# EAGLE design Leddriverboard (EAGLE 6.4)
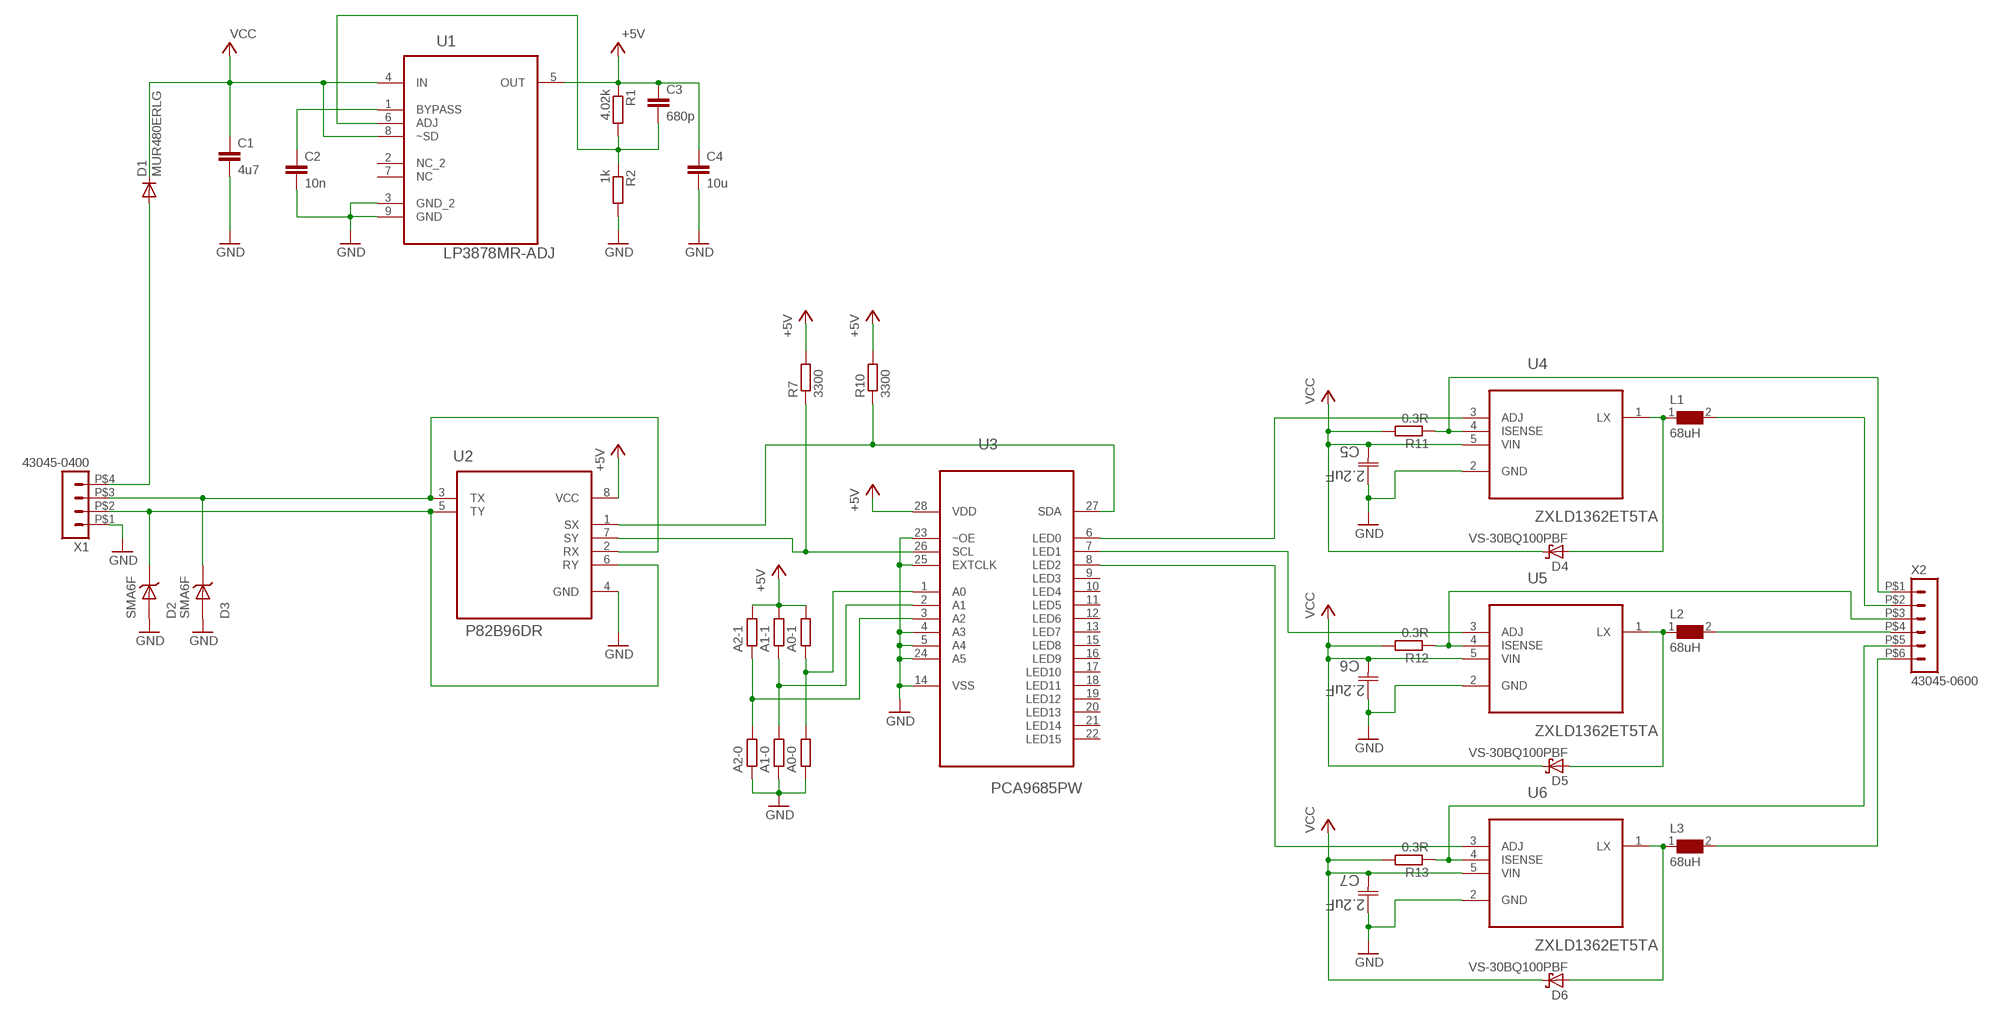
[diagram p0: schematic, sheet 1]

## Parts
C1  4u7  C-EUC0805  [C0805]
C2  10n  C-EUC0805  [C0805]
C3  680p  C-EUC0805  [C0805]
C4  10u  C-EUC0805  [C0805]
C5  2.2uF  08053C225KAT2A  [CAPC2013X152N]
C6  2.2uF  08053C225KAT2A  [CAPC2013X152N]
C7  2.2uF  08053C225KAT2A  [CAPC2013X152N]
D1  MUR480ERLG  MUR150RL  [DO41-10]
D2  SMA6F  [DO-221AC]
D3  SMA6F  [DO-221AC]
D4  VS-30BQ100PBF  [DO-214AB]
D5  VS-30BQ100PBF  [DO-214AB]
D6  VS-30BQ100PBF  [DO-214AB]
L1  68uH  WE-PD4-74456168_L  [L]
L2  68uH  WE-PD4-74456168_L  [L]
L3  68uH  WE-PD4-74456168_L  [L]
R1  4.02k  R-EU_R0603  [R0603]
R2  1k  R-EU_R0603  [R0603]
R3  A2-1  R-EU_R0402  [R0402]
R4  A2-0  R-EU_R0402  [R0402]
R5  A1-1  R-EU_R0402  [R0402]
R6  A1-0  R-EU_R0402  [R0402]
R7  3300  R-EU_0204/7  [0204/7]
R8  A0-1  R-EU_R0402  [R0402]
R9  A0-0  R-EU_R0402  [R0402]
R10  3300  R-EU_0204/7  [0204/7]
R11  0.3R  R-EU_R0603  [R0603]
R12  0.3R  R-EU_R0603  [R0603]
R13  0.3R  R-EU_R0603  [R0603]
U1  LP3878MR-ADJ  [SOIC127P600X168-8N]
U2  P82B96DR  [SOIC127P600X175-8N]
U3  PCA9685PW  [SOP65P640X110-28N]
U4  ZXLD1362ET5TA  [SOT95P270X145-5N]
U5  ZXLD1362ET5TA  [SOT95P270X145-5N]
U6  ZXLD1362ET5TA  [SOT95P270X145-5N]
X1  43045-0400  HEADER_POS4_43045-0401  [43045-0400]
X2  43045-0600  HEADER_POS6_43045-0600  [43045-0600]

## Nets
+5V [Normal Bcc]: C3.1 C4.1 R1.1 R3.2 R5.2 R7.2 R8.2 R10.2 U1.5(OUT) U2.8(VCC) U3.28(VDD)
GND: C1.2 C2.2 C4.2 C5.1(C1) C6.1(C1) C7.1(C1) D2.AN D3.AN R2.2 R4.1 R6.1 R9.1 U1.3(GND_2) U1.9(GND) U2.4(GND) U3.4(A3) U3.5(A4) U3.14(VSS) U3.23(~OE) U3.24(A5) U3.25(EXTCLK) U4.2(GND) U5.2(GND) U6.2(GND) X1.P$1
N$1 [LED Current]: R11.1 U4.4(ISENSE) X2.P$1
N$2: U3.7(LED1) U5.3(ADJ)
N$4 [LED Current]: R12.1 U5.4(ISENSE) X2.P$3
N$5 [LED Current]: L2.2 X2.P$4
N$6 [LED Current]: L1.2 X2.P$2
N$7: D3.KAT U2.2(RX) U2.3(TX) X1.P$3
N$8: U3.6(LED0) U4.3(ADJ)
N$9 [LED Current]: D5.A L2.1 U5.1(LX)
N$10 [LED Current]: D4.A L1.1 U4.1(LX)
N$15: U3.8(LED2) U6.3(ADJ)
N$16 [LED Current]: R13.1 U6.4(ISENSE) X2.P$5
N$18 [LED Current]: L3.2 X2.P$6
N$19 [LED Current]: D6.A L3.1 U6.1(LX)
N$22: D2.KAT U2.5(TY) U2.6(RY) X1.P$2
N$24: C3.2 R1.2 R2.1 U1.6(ADJ)
N$25 [Big Vcc]: D1.A X1.P$4
N$26: C2.1 U1.1(BYPASS)
N$41: R8.1 R9.2 U3.1(A0)
N$42: R5.1 R6.2 U3.2(A1)
N$43: R3.1 R4.2 U3.3(A2)
SCL: R7.1 U2.7(SY) U3.26(SCL)
SDA: R10.1 U2.1(SX) U3.27(SDA)
VCC [Big Vcc]: C1.1 C5.2(C2) C6.2(C2) C7.2(C2) D1.C D4.K(C) D5.K(C) D6.K(C) R11.2 R12.2 R13.2 U1.4(IN) U1.8(~SD) U4.5(VIN) U5.5(VIN) U6.5(VIN)
Unconnected: U1.2(NC_2) U1.7(NC) U3.9(LED3) U3.10(LED4) U3.11(LED5) U3.12(LED6) U3.13(LED7) U3.15(LED8) U3.16(LED9) U3.17(LED10) U3.18(LED11) U3.19(LED12) U3.20(LED13) U3.21(LED14) U3.22(LED15)

## Library data of the parts
C1-C4 = rcl:C-EU: CAPACITOR, European symbol
C5-C7 = AVX_By_element14_Batch_1:08053C225KAT2A: Capacitor 0805; MPN: 08053C225KAT2A; OC_FARNELL: 1657931; OC_NEWARK: 10R5975; SUPPLIER: AVX; TOLERANCE: ±10%; VOLTAGERATING: 25V
D1 = diode:MUR150RL: DIODE
D2 D3 = MyComponents:SMA6F
D4-D6 = MyComponents:VS-30BQ100PBF
L1-L3 = WE-PD4:WE-PD4: SMD-Power Inductors WE-PD4 - Current loading up to 35 A - Compact size - Low-loss ferrite core - High storage capacity - Industry standardized size - Application frequency range up to 10 MHz -- Is recommended for the application with switching regulators from National Semiconductor, Linear Technology, Texas Instruments and Fairchild Semiconductor -- Noise suppression -- Perfectly suitable for switching regulators with extremely high efficiency; MPN: 74456168; OC_FARNELL: 1636136; OC_NEWARK: 08P2689; PACKAGE: Type_L; SUPPLIER: Wuerth Elektronik
R1-R6 R8 R9 R11-R13 = resistor:R-EU_: RESISTOR, European symbol
R7 R10 = rcl:R-EU_: RESISTOR, European symbol
U1 = Texas:LP3878MR-ADJ: Voltage Regulator; MPN: LP3878MR-ADJ; OC_FARNELL: 1286784; OC_NEWARK: 65K6513; PACKAGE: SOIC-8; SUPPLIER: NationalSemiconductor
U2 = Texas:P82B96DR: DUAL BIDIRECTIONAL BUS BUFFER; MPN: P82B96DR; OC_FARNELL: 1576671; OC_NEWARK: 88K6385; PACKAGE: SOIC-8; SUPPLIER: Texas Instruments
U3 = NXP_By_element14_Batch_1:PCA9685PW: 16-channel, 12-bit PWM Fm+ I2C-bus LED controller; MPN: PCA9685PW; OC_FARNELL: 1854074; OC_NEWARK: 19T6398; PACKAGE: TSSOP-28; SUPPLIER: NXP
U4-U6 = ZEtex:ZXLD1362ET5TA: 60V 1A LED DRIVER WITH AEC-Q100; MPN: ZXLD1362ET5TA; OC_FARNELL: 1843876; OC_NEWARK: 12T2272; PACKAGE: SOT-5; SUPPLIER: DIODES INC.
X1 = con-molex-micro-fit-3_0:HEADER_POS4_?: Molex - Micro-Fit 3.0 Series connector, 3.00mm (0.118") pitch header, 4 positions.
X2 = con-molex-micro-fit-3_0:HEADER_POS6_?: Molex - Micro-Fit 3.0 Series connector, 3.00mm (0.118") pitch header, 6 positions.

## Net classes
0 default: width 0.254 mm, clearance 0.254 mm
1 Normal Bcc: width 0.254 mm, clearance 0.254 mm
2 Big Vcc: width 0.762 mm, clearance 0.254 mm
3 LED Current: width 0.381 mm, clearance 0.254 mm

## Board
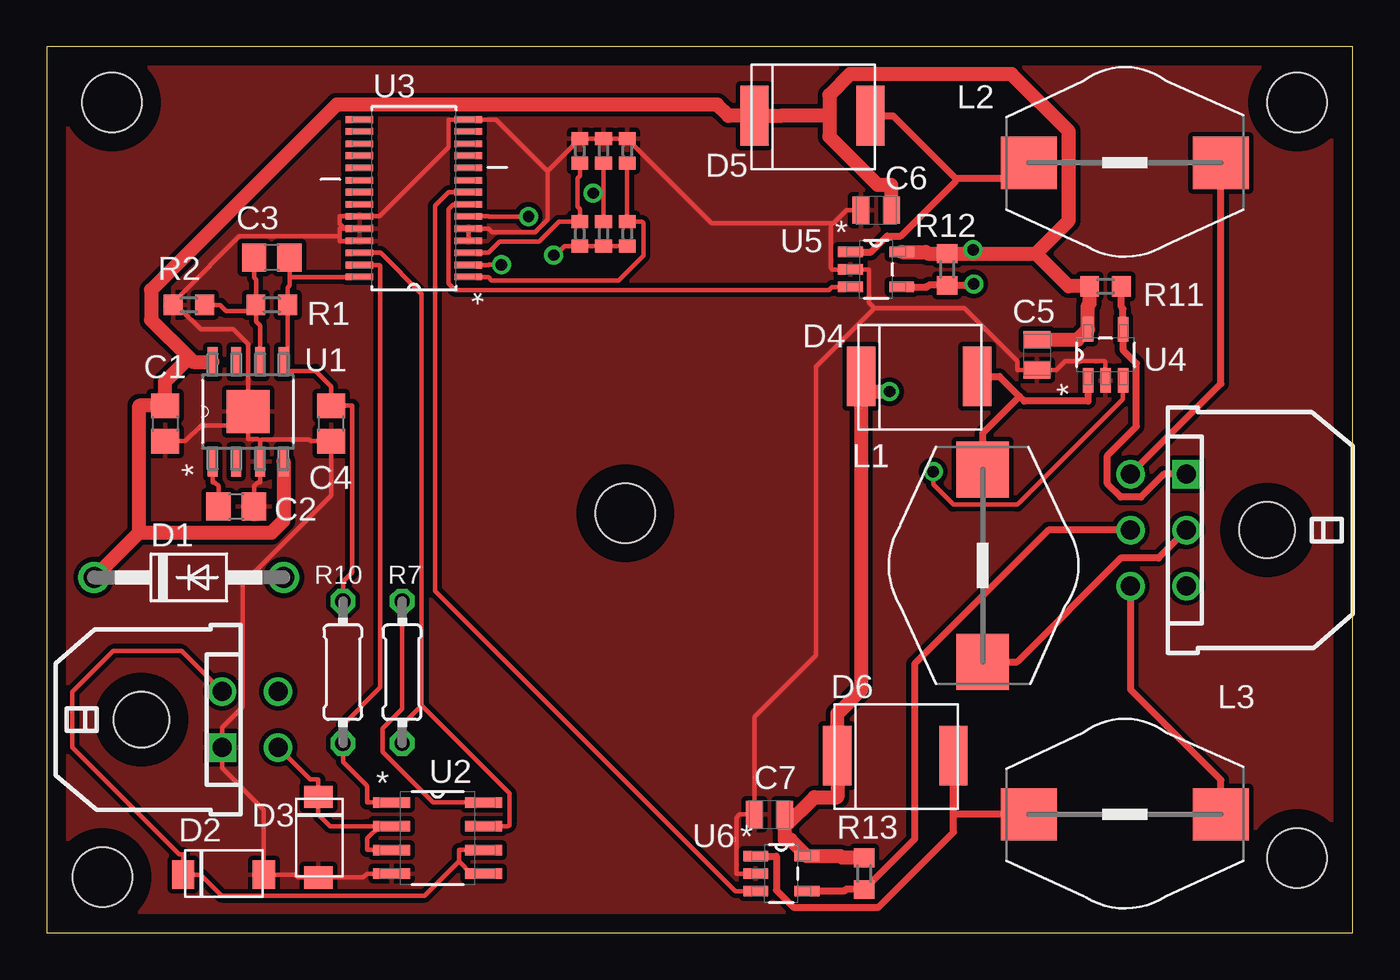
[diagram p1: board, top side]
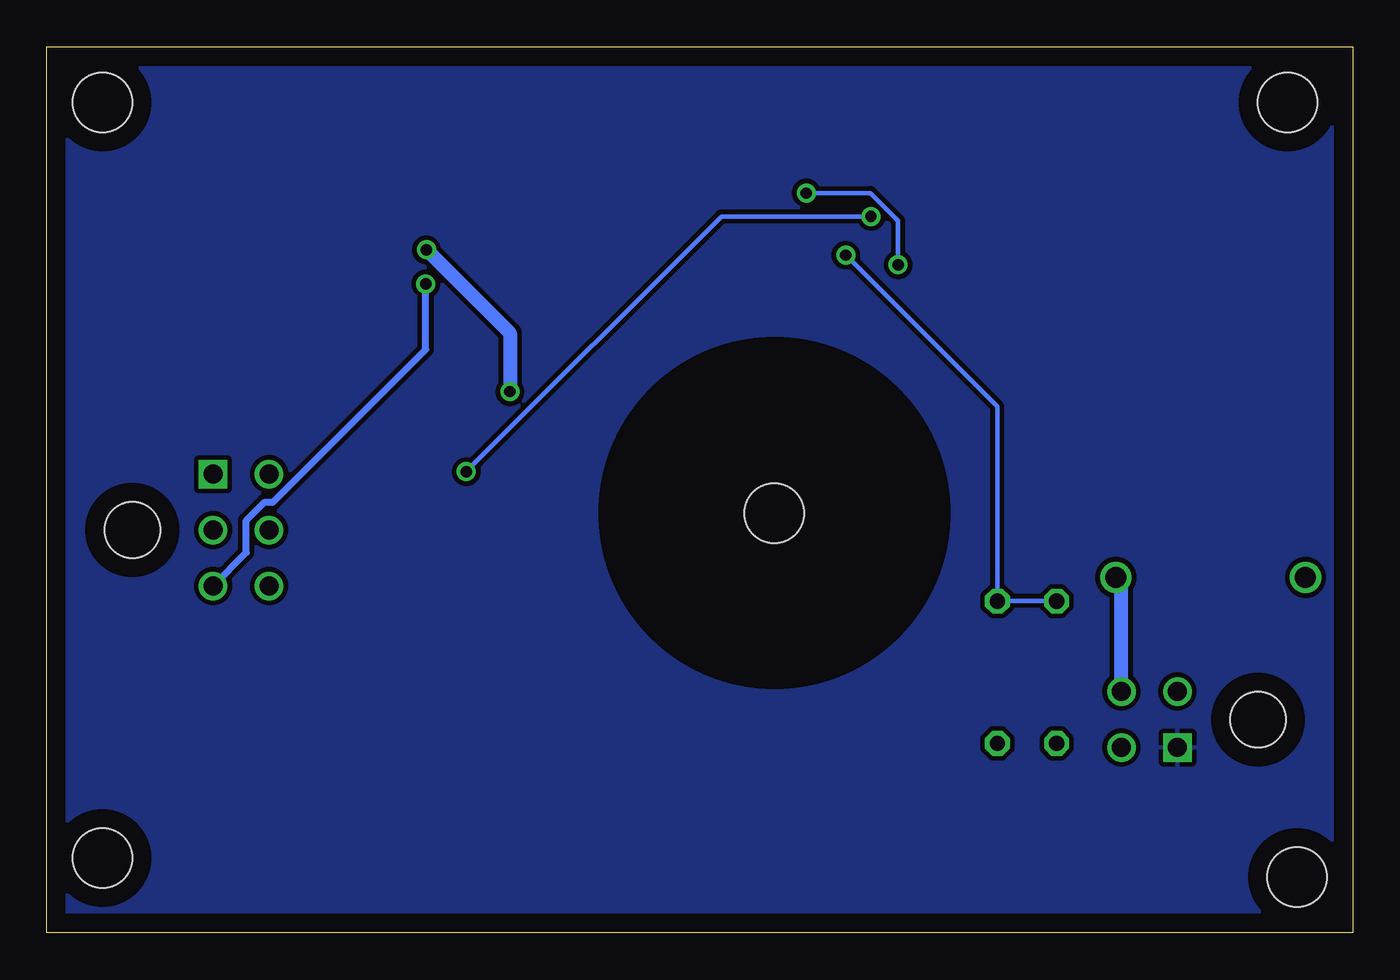
[diagram p2: board, bottom side, seen from below]

Size 70 x 47.5 mm. Coordinates in mm from the lower left corner, seen from the top.
Outline: 0,0 70,0 70,47.5 0,47.5 0,0
Copper layers (1*16): Top 0.035mm / dielectric 1.5mm / Bottom 0.035mm
Design rules "default": minimum track width 10mil, minimum drill 24mil, track to track 8mil, track to pad 8mil, pad to pad 8mil, via to via 8mil, smd to smd 8mil, copper to edge 40mil, drill to drill 8mil, minimum pad ring 10mil, minimum via ring 8mil, stop-mask expansion 4mil, vias tented up to drill 0mil, thermal gap 10mil
Holes 3.2 mm at 3.5,44.5 67,44.5 67,4 3,3 31,22.5
bRestrict: area 22,13.5 to 40,31.5

### Footprints (pad centres in the part's own frame; a part is rotated, then mirrored left to right if it is on the bottom)
C0805 = smd 1.3 x 1.5: 1 -0.95,0; 2 0.95,0
CAPC2013X152N = smd 0.914 x 1.448: 1 -0.813,0; 2 0.813,0
DO41-10 = drill 1.118: A 5.08,0; C -5.08,0
DO-221AC = smd 1.2 x 1.52: AN 2.11,-0.05; KAT -2.21,-0.05
DO-214AB = smd 1.52 x 3.2: A 4.78,-0.02; K -1.44,-0.02
L = smd 3 x 2.8: 1 -5.15,0; 2 5.15,0
R0603 = smd 1 x 1.1: 1 -0.85,0; 2 0.85,0
R0402 = smd 0.7 x 0.9: 1 -0.65,0; 2 0.65,0
0204/7 = drill 0.813 octagon: 1 -3.81,0; 2 3.81,0
SOIC127P600X168-8N = smd 1.6 x 0.533: 1 -2.667,1.905; 2 -2.667,0.635; 3 -2.667,-0.635; 4 -2.667,-1.905; 5 2.667,-1.905; 6 2.667,-0.635; 7 2.667,0.635; 8 2.667,1.905 | smd 2.286 x 2.286: 9 0,0
SOIC127P600X175-8N = smd 1.981 x 0.559: 1 -2.464,1.905; 2 -2.464,0.635; 3 -2.464,-0.635; 4 -2.464,-1.905; 5 2.464,-1.905; 6 2.464,-0.635; 7 2.464,0.635; 8 2.464,1.905
SOP65P640X110-28N = smd 1.473 x 0.356: 1 -2.921,4.216; 2 -2.921,3.581; 3 -2.921,2.921; 4 -2.921,2.286; 5 -2.921,1.626; 6 -2.921,0.965; 7 -2.921,0.33; 8 -2.921,-0.33; 9 -2.921,-0.965; 10 -2.921,-1.626; 11 -2.921,-2.286; 12 -2.921,-2.921; 13 -2.921,-3.581; 14 -2.921,-4.216; 15 2.921,-4.216; 16 2.921,-3.581; 17 2.921,-2.921; 18 2.921,-2.286; 19 2.921,-1.626; 20 2.921,-0.965; 21 2.921,-0.33; 22 2.921,0.33; 23 2.921,0.965; 24 2.921,1.626; 25 2.921,2.286; 26 2.921,2.921; 27 2.921,3.581; 28 2.921,4.216
SOT95P270X145-5N = smd 1.321 x 0.559: 1 -1.372,0.94; 2 -1.372,0; 3 -1.372,-0.94; 4 1.372,-0.94; 5 1.372,0.94
43045-0400 = drill 1.02 square: P$1 1.5,4.32 | drill 1.02: P$2 -1.5,4.32; P$3 1.5,7.32; P$4 -1.5,7.32 | hole 3: 0,0
43045-0600 = drill 1.02 square: P$1 3,4.32 | drill 1.02: P$2 0,4.32; P$3 -3,4.32; P$4 3,7.32; P$5 0,7.32; P$6 -3,7.32 | hole 3: 0,0

### Placement (x,y rotation side)
C1  6.35,27.3 270 top
C2  10.16,22.86 0 top
C3  12.06,36.2 180 top
C4  15.24,27.3 270 top
C5  53.07,30.98 90 top
C6  44.45,38.73 0 top
C7  38.73,6.35 0 top
D1  7.62,19.05 0 top
D2  9.53,3.17 0 top
D3  14.61,5.08 270 top
D4  45.09,29.84 0 top
D5  39.37,43.81 0 top
D6  43.81,9.53 0 top
L1  50.16,19.68 270 top
L2  57.78,41.27 0 top
L3  57.78,6.35 0 top
R1  12.06,33.66 180 top
R2  7.62,33.66 180 top
R3  28.57,37.47 270 top
R4  28.57,41.91 270 top
R5  29.84,37.47 270 top
R6  29.84,41.91 270 top
R7  19.05,13.97 90 top
R8  31.11,37.47 270 top
R9  31.11,41.91 270 top
R10  15.88,13.97 90 top
R11  56.74,34.66 180 top
R12  48.26,35.56 90 top
R13  43.81,3.17 90 top
U1  10.79,27.94 90 top
U2  20.95,5.08 0 top
U3  19.68,39.37 180 top
U4  56.74,30.98 90 top
U5  44.45,35.56 0 top
U6  39.37,3.17 0 top
X1  5.08,11.43 270 top
X2  65.41,21.59 90 top

### Tracks (layer width: path | path; a pad name or v marks a point on that pad's centre or on a via)
+5V  (via drill 0.61 pad 1.02)
  Top 0.254: v27.17,36.33 27.25,36.33 27.74,36.81 R3.2 R5.2 R8.2 | 13.02,35.15 C3.1 | 13.02,35.15 13.02,34.69 12.91,34.59 R1.1 12.91,30.12 | 13.02,35.15 15.65,35.15 U3.28 | 12.91,30.12 14.4,30.12 15.24,29.29 C4.1 16.37,28.25 16.37,19.32 15.88,18.82 R10.2 | 12.91,30.12 12.81,30.12 12.7,30.02 U1.5 | R7.2 19.05,12.01 18.01,10.97 18.01,9.69 20.71,6.99 U2.8
  Bottom 0.254: v27.17,36.33 19.05,28.2 R7.2 R10.2
GND
  Top 0.254: C1.2 7.43,26.36 8.28,27.2 10.79,27.2 | 10.79,27.2 10.79,26.47 11.32,26.47 11.43,26.35 | 10.79,27.2 U1.9 10.79,31.56 10.01,32.35 8.25,32.35 7.18,33.41 7.18,33.66 | 11.43,26.35 11.53,26.45 14.06,26.45 14.16,26.36 C4.2 15.24,25.38 | 11.43,26.35 11.43,26.3 U1.3 11.43,24.14 11.31,24.14 11.11,23.94 C2.2 | 44.35,33.48 49.19,33.48 52.02,30.66 52.02,30.17 C5.1 54.12,30.17 54.61,30.65 56.69,30.65 56.74,30.6 U4.2 | 44.35,33.48 44.07,33.77 44.07,35.56 U5.2 42.09,35.56 42.03,35.62 42.03,38.05 | 44.35,33.48 41.23,30.36 41.23,14.88 37.92,11.57 C7.1 37.13,6.35 36.96,6.17 36.96,3.23 37.01,3.17 U6.2 | U2.4 17.17,3.17 16.96,2.97 D3.AN 13.46,2.97 13.31,3.12 D2.AN 11.63,6.6 9.4,8.84 X1.P$1 9.4,10.43 9.4,11.03 10.49,12.12 10.49,18.69 15.24,23.44 15.24,25.38 | 15.24,25.38 | 26.85,40.83 26.85,38.23 26.17,37.55 23.86,37.55 23.67,37.74 U3.5 U3.4 | 26.85,40.83 24.1,43.59 U3.14 21.54,43.59 21.54,42.11 17.83,38.41 U3.23 15.7,38.41 15.7,38.02 15.98,37.74 | 26.85,40.83 R4.1 28.57,42.57 29.05,42.57 29.07,42.56 R6.1 R9.1 35.63,38.05 42.03,38.05 | 42.03,38.05 42.16,38.05 42.85,38.73 C6.1 | 15.98,37.74 16.23,37.74 U3.24 | 15.98,37.74 15.7,37.74 15.7,37.33 | 15.7,37.33 15.7,37.08 U3.25 | 7.18,33.66 7.18,34.19 10.33,37.33 15.7,37.33 | R2.2 7.18,33.66
  pour Top: 0,47.5 70.1,47.5 70.1,0 0,0
  pour Bottom: 0,47.5 70.1,47.5 70.1,0 0,0
N$1
  Top 0.381: X2.P$1 59.88,24.59 58.64,23.36 57.56,23.36 56.85,24.07 56.85,25.59 58.41,27.15 58.41,30.52 57.69,31.25 U4.4 57.69,33.46 57.59,33.55 R11.1
N$2
  Top 0.254: U5.3 42.09,34.62 41.92,34.45 21.89,34.45 21.54,34.81 21.54,38.8 21.78,39.04 U3.7
N$4  (via drill 0.61 pad 1.02)
  Top 0.381: v49.69,34.78 49.32,34.78 49.26,34.71 R12.1 47.27,34.71 47.18,34.62 U5.4
  Bottom 0.381: X2.P$3 59.3,20.38 59.3,22.11 58.31,23.09 57.86,23.09 49.69,31.27 v49.69,34.78
N$5
  Top 0.381: X2.P$4 62.94,29.44 L2.2
N$6
  Top 0.381: L1.2 52.01,14.54 57.56,20.09 59.59,20.09 X2.P$2
N$7
  Top 0.254: X1.P$3 14.11,8.22 14.55,8.22 D3.KAT 14.55,6.36 15.2,5.71 17.17,5.71 17.83,5.71 | U2.3 17.17,4.45 17.17,5.05 17.83,5.71 | U2.2 17.83,5.71
N$8  (via drill 0.61 pad 1.02)
  Top 0.254: U4.3 57.69,28.62 52.02,22.95 48.59,22.95 47.52,24.03 v47.52,24.72 | U3.6 23.67,38.41 23.68,38.39 v25.82,38.39
  Bottom 0.254: v25.82,38.39 33.84,38.39 v47.52,24.72
N$9
  Top 0.381: U5.1 44.18,36.5 45.04,37.35 45.77,37.35 48.72,40.3 48.72,40.43 | 48.72,40.43 45.35,43.8 D5.A | 48.72,40.43 52.63,40.43 L2.1
N$10
  Top 0.381: U4.1 55.8,28.5 52.39,28.5 52.14,28.75 | 52.14,28.75 51.07,29.82 D4.A | 52.14,28.75 50.16,26.78 L1.1
N$15
  Top 0.254: U3.8 21.54,39.7 20.82,38.98 20.82,18.34 36.92,2.23 U6.3
N$16
  Top 0.381: U6.4 42.73,2.23 42.82,2.33 R13.1 46.51,5.02 46.51,14.41 53.69,21.59 X2.P$5
N$18
  Top 0.381: L3.2 62.94,8.2 58.09,13.04 X2.P$6
N$19
  Top 0.381: 48.59,6.35 D6.A | 48.59,6.35 48.59,5.39 44.58,1.38 40.02,1.38 39.1,2.29 39.1,4.12 U6.1 | L3.1 48.59,6.35
N$22
  Top 0.254: 22.1,3.84 20.26,2 9.37,2 8.24,3.12 D2.KAT 7.32,3.67 7.32,4.21 7.1,4.21 1.38,9.94 1.38,12.91 3.57,15.1 7.23,15.1 X1.P$2 | 22.1,3.84 22.1,4.45 U2.6 | 22.1,3.84 22.76,3.17 U2.5
N$24
  Top 0.254: C3.2 11.12,35.12 11.21,35.02 R1.2 11.21,33.5 11.21,33.34 | R2.1 9.3,33.66 9.62,33.34 11.21,33.34 | 11.21,33.34 11.21,32.77 11.43,32.56 U1.6
N$25
  Bottom 0.762: X1.P$4 12.4,18.75 D1.A
N$26
  Top 0.254: U1.1 8.89,24.14 9.01,24.14 9.21,23.94 C2.1
N$41
  Top 0.254: U3.1 23.67,35.15 23.86,34.97 30.64,34.97 31.98,36.31 31.98,38.03 31.89,38.12 R8.1 R9.2
N$42  (via drill 0.61 pad 1.02)
  Top 0.254: U3.2 23.67,35.79 23.69,35.81 v24.37,35.81 | 29.84,39.65 R5.1 | R6.2 29.84,39.65 | v29.29,39.65 29.84,39.65
  Bottom 0.254: v29.29,39.65 25.86,39.65 24.37,38.16 v24.37,35.81
N$43
  Top 0.254: U3.3 23.67,36.45 24.27,37.05 26.38,37.05 27.45,38.12 27.8,38.12 R3.1 28.57,38.8 28.45,38.92 28.45,40.46 28.57,40.58 R4.2
SCL
  Top 0.254: 20.09,12.19 19.05,11.15 R7.1 | U3.26 17.89,36.45 20.09,34.25 20.09,12.19 | 20.09,12.19 24.8,7.49 24.8,5.77 24.74,5.71 U2.7
SDA
  Top 0.254: U2.1 17.17,6.99 17.17,7.87 15.88,9.17 R10.1 15.88,11.15 17.88,13.16 17.88,35.74 17.83,35.79 U3.27
VCC  (via drill 0.61 pad 1.02)
  Top 0.762: 43.65,29.01 43.65,13.01 42.38,11.74 D6.K 42.38,7.27 41.15,7.27 39.55,5.67 | D4.K 43.65,29.01 | 43.65,29.01 v45.17,29.01 | 49.45,36.41 53.01,36.41 | 49.45,36.41 R12.2 47.21,36.41 47.12,36.5 U5.5 | v49.64,36.61 49.45,36.42 49.45,36.41 | 41.94,43.8 41.94,42.68 44.53,40.09 45.26,40.09 C6.2 | 53.01,36.41 54.77,38.17 54.77,42.96 51.7,46.03 43.06,46.03 41.94,44.91 41.94,43.8 | 41.94,43.8 39.33,43.8 D5.K 36.53,43.8 35.93,44.4 15.54,44.4 5.6,34.46 5.6,32.86 7.63,30.82 | 7.63,30.82 7.85,30.61 U1.8 | 7.63,30.82 6.35,29.54 C1.1 4.96,28.25 4.96,21.43 | 4.96,21.43 4.92,21.43 D1.C | U1.4 12.7,22.1 12.03,21.43 4.96,21.43 | 53.01,36.41 54.76,34.66 R11.2 55.9,33.74 55.8,33.65 U4.5 55.25,31.79 C5.2 | 39.55,5.67 39.55,4.99 39.87,4.99 U6.5 42.54,4.12 42.63,4.03 R13.2 | C7.2 39.55,5.67
  Bottom 0.762: v49.64,36.61 45.17,32.14 v45.17,29.01